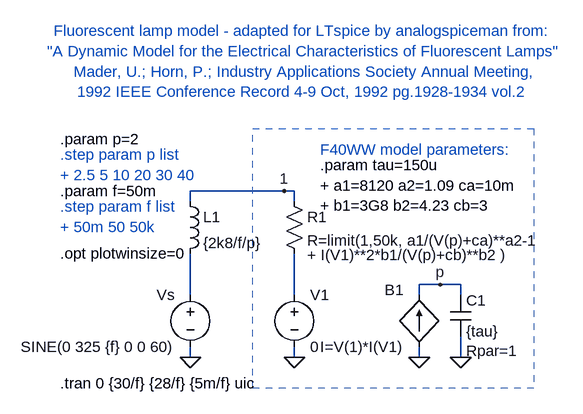
[diagram p0: schematic Fluorescent.asc]
Fluorescent.asc, the LTspice schematic file:
Version 4
SHEET 1 880 680
WIRE 0 112 -144 112
WIRE 16 112 0 112
WIRE -144 128 -144 112
WIRE 16 128 16 112
WIRE 240 256 208 256
WIRE 272 256 240 256
WIRE -144 272 -144 208
WIRE 16 272 16 208
WIRE 208 272 208 256
WIRE 272 272 272 256
WIRE -144 368 -144 352
WIRE 16 368 16 352
WIRE 208 368 208 352
WIRE 272 368 272 336
FLAG -144 368 0
FLAG 16 368 0
FLAG 0 112 1
FLAG 272 368 0
FLAG 208 368 0
FLAG 240 256 p
SYMBOL res 0 112 R0
WINDOW 123 36 98 Left 0
SYMATTR Value2 + I(V1)**2*b1/(V(p)+cb)**b2 )
SYMATTR InstName R1
SYMATTR Value R=limit(1,50k, a1/(V(p)+ca)**a2-1
SYMBOL voltage 16 256 R0
SYMATTR InstName V1
SYMATTR Value 0
SYMBOL bi 208 352 R180
WINDOW 0 24 88 Left 0
WINDOW 3 24 0 Left 0
SYMATTR InstName B1
SYMATTR Value I=V(1)*I(V1)
SYMBOL cap 256 272 R0
WINDOW 39 24 86 Left 0
SYMATTR SpiceLine Rpar=1
SYMATTR InstName C1
SYMATTR Value {tau}
SYMBOL voltage -144 256 M0
WINDOW 123 0 0 Left 0
WINDOW 39 0 0 Left 0
SYMATTR InstName Vs
SYMATTR Value SINE(0 325 {f} 0 0 60)
SYMBOL ind -160 112 R0
SYMATTR InstName L1
SYMATTR Value {2k8/f/p}
SYMATTR SpiceLine Rser=1
TEXT -344 56 Left 0 ;.step param p list\n+ 2.5 5 10 20 30 40
TEXT -344 32 Left 0 !.param p=2
TEXT -344 408 Left 0 !.tran 0 {30/f} {28/f} {5m/f} uic
TEXT -344 208 Left 0 !.opt plotwinsize=0
TEXT 56 72 Left 0 !.param tau=150u\n+ a1=8120 a2=1.09 ca=10m\n+ b1=3G8 b2=4.23 cb=3
TEXT 32 -88 Center 0 ;Fluorescent lamp model - adapted for LTspice by analogspiceman from:\n"A Dynamic Model for the Electrical Characteristics of Fluorescent Lamps"\nMader, U.; Horn, P.; Industry Applications Society Annual Meeting,\n1992 IEEE Conference Record 4-9 Oct, 1992 pg.1928-1934 vol.2
TEXT 56 48 Left 0 ;F40WW model parameters:
TEXT -344 112 Left 0 !.param f=50m
TEXT -344 136 Left 0 ;.step param f list\n+ 50m 50 50k
RECTANGLE Normal 384 416 -48 16 1

The netlist it stands for:
* Fluorescent.asc
R1 1 N002 R=limit(1,50k, a1/(V(p)+ca)**a2-1 + I(V1)**2*b1/(V(p)+cb)**b2 )
V1 N002 0 0
B1 0 p I=V(1)*I(V1)
C1 p 0 {tau} Rpar=1
Vs N001 0 SINE(0 325 {f} 0 0 60)
L1 1 N001 {2k8/f/p} Rser=1
* .step param p list
* + 2.5 5 10 20 30 40
.param p=2
.tran 0 {30/f} {28/f} {5m/f} uic
.opt plotwinsize=0
.param tau=150u
+ a1=8120 a2=1.09 ca=10m
+ b1=3G8 b2=4.23 cb=3
* Fluorescent lamp model - adapted for LTspice by analogspiceman from:
* "A Dynamic Model for the Electrical Characteristics of Fluorescent Lamps"
* Mader, U.; Horn, P.; Industry Applications Society Annual Meeting,
* 1992 IEEE Conference Record 4-9 Oct, 1992 pg.1928-1934 vol.2
* F40WW model parameters:
.param f=50m
* .step param f list
* + 50m 50 50k
.backanno
.end